# Altium schematic sheet Encoder.SchDoc
size B; DocumentNumber: 5; SheetNumber: 5; SheetTotal: 14; PAGE_TITLE: -
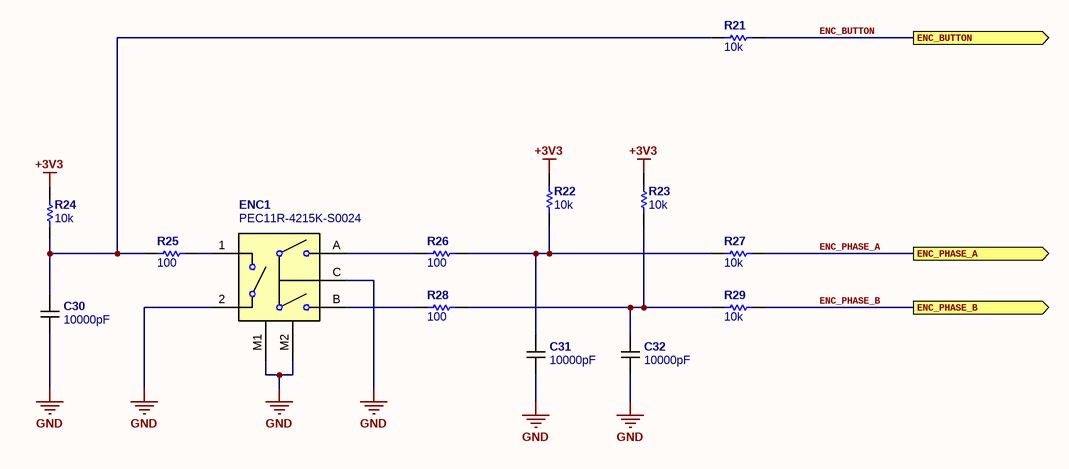
[diagram p0: Encoder.SchDoc]

## Parts
C30  10000pF  [C0603_0.90MM_HD]
C31  10000pF  [C0603_0.90MM_HD]
C32  10000pF  [C0603_0.90MM_HD]
ENC1  PEC11R-4215K-S0024  [PEC11R-4215K-S0024]
R21  10k  [R0603_0.55MM_MD]
R22  10k  [R0603_0.55MM_MD]
R23  10k  [R0603_0.55MM_MD]
R24  10k  [R0603_0.55MM_MD]
R25  100  [R0603_0.55MM_MD]
R26  100  [R0603_0.55MM_MD]
R27  10k  [R0603_0.55MM_MD]
R28  100  [R0603_0.55MM_MD]
R29  10k  [R0603_0.55MM_MD]

## Ports
ENC_BUTTON (out), ENC_PHASE_A (out), ENC_PHASE_B (out)

## Nets
+3V3: R22.2 R23.2 R24.2
GND: C30.1 C31.1 C32.1 ENC1.2 ENC1.C ENC1.M1 ENC1.M2
ENC_BUTTON: R21.1 ; port ENC_BUTTON
ENC_PHASE_A: R27.1 ; port ENC_PHASE_A
ENC_PHASE_B: R29.1 ; port ENC_PHASE_B
NetC30_2: C30.2 R21.2 R24.1 R25.2
NetC31_2: C31.2 R22.1 R26.1 R27.2
NetC32_2: C32.2 R23.1 R28.1 R29.2
NetENC1_1: ENC1.1 R25.1
NetENC1_A: ENC1.A R26.2
NetENC1_B: ENC1.B R28.2

## Notes on the sheet
- PCB REV
- Sheet
- of
- CCA REV

## Library data of the parts
C30-C32 = CGA3E2C0G1H103J080AA: CAP CER 10000PF 50V C0G 0603; Manufacturer: TDK Corporation; Temperature Coefficient: C0G, NP0; Tolerance: ±5%; Substitution Notes: 10000pF , 50V , ±5% , C0G, NP0 , -55°C ~ 125°C , AEC-Q200 , 0603; Value: 10000pF; Manufacturer Part Number: CGA3E2C0G1H103J080AA; ComponentLink1Description: Datasheet (Internal); ComponentLink1URL: datasheets\TDK\mlcc_automotive_general_en.pdf; ComponentLink2Description: Datasheet (External); ComponentLink2URL: https://product.tdk.com/info/en/catalog/datasheets/mlcc_automotive_general_en.pdf; Supplier 1: Digikey; Supplier Part Number 1: 445-6916-1-ND; Category: Capacitors; Voltage - Rated: 50V; Features: -; Operating Temperature: -55°C ~ 125°C; Ratings: AEC-Q200; Package: 0603; Thickness (Max): 0.90MM
ENC1 = PEC11R-4215K-S0024: Encoders 15mm SHAFT w/SWITCH; Manufacturer: Bourns; Number of Channels: 2; Pulses per Revolution: 24; Built in Switch: Yes; Encoder Type: Mechanical; Output Type: Quadrature,Incremental; Max Supply Voltage (DC): 5V; Hole Diameter: 1.8mm; Value: PEC11R-4215K-S0024; Supplier 1: Digi-Key; Supplier Part Number 1: PEC11R-4215K-S0024-ND; Manufacturer Part Number: PEC11R-4215K-S0024; RoHS: Yes; Category: Encoders; Stock: 2990; Pricing: 1=1.68000, 10=1.56600, 25=1.47920, 50=1.30500, 100=1.07300, 250=1.04400, 500=0.98600, 1000=0.92800, 5000=0.81200 (USD); Mount: Through Hole,Panel,PCB; Min Operating Temperature: -30°C; Max Operating Temperature: 70°C; Package Quantity: 150; Packaging: Bulk; Termination: PC Pin; Orientation: Vertical; Detent: Yes; Length: 21.5mm; Height: 13.4mm; Width: 12.5mm; REACH SVHC: No SVHC; ComponentLink1URL: https://datasheet.ciiva.com/29349/pec11r-29349515.pdf?src-supplier=Digi-Key; ComponentLink1Description: https://datasheet.ciiva.com/29349/pec11r-29349515.pdf?src-supplier=Digi-Key; ComponentLink2URL: https://datasheet.ciiva.com/30066/pec11r-221203-30066108.pdf?src-supplier=Onlinecomponents.com; ComponentLink2Description: https://datasheet.ciiva.com/30066/pec11r-221203-30066108.pdf?src-supplier=Onlinecomponents.com; ComponentLink3URL: https://datasheet.ciiva.com/12176/pec11r-221203-12176991.pdf?src-supplier=Mouser; ComponentLink3Description: https://datasheet.ciiva.com/12176/pec11r-221203-12176991.pdf?src-supplier=Mouser
R21-R24 R27 R29 = ERJ-3EKF1002V: RES 10K OHM 1/10W 1% 0603 SMD; Manufacturer: Panasonic Electronic Components; Package Power: 0603  (0.1W); Power (Watts): 0.1W- 1/10W; Temperature Coefficient: ±100ppm/°C; Limiting Element Voltage: 75; Maximum Overload Voltage: 150; Maximum Working Voltage: 31.6V; Substitution Notes: 10k , ±1% , 0603 , AEC-Q200; Value: 10k; Manufacturer Part Number: ERJ-3EKF1002V; ComponentLink1Description: Internal Datasheet; ComponentLink1URL: datasheets\Panasonic Electronic Components\AOA0000CE2.pdf; ComponentLink2Description: External Datasheet; ComponentLink2URL: http://industrial.panasonic.com/www-data/pdf/AOA0000/AOA0000CE2.pdf; Supplier 1: Digi-Key; Supplier Part Number 1: P10.0KHCT-ND; Category: Resistors; Resistance (Ohms): 10k; Composition: Thick Film; Features: -; Tolerance: ±1%; Package: 0603 (1608 Metric); Supplier Package: 0603; Size / Dimension: 0.063" L x 0.031" W (1.60mm x 0.80mm); Height: 0.55MM; Number of Terminations: 2; Packaging: Cut Tape (CT); Sort Value: 10000; Sort Value Package: 603_10000; Ratings: AEC-Q200
R25 R26 R28 = ERJ-3EKF1000V: RES 100 OHM 1/10W 1% 0603 SMD; Manufacturer: Panasonic Electronic Components; Package Power: 0603  (0.1W); Power (Watts): 0.1W- 1/10W; Temperature Coefficient: ±100ppm/°C; Limiting Element Voltage: 75; Maximum Overload Voltage: 150; Maximum Working Voltage: 3.2V; Substitution Notes: 100 , ±1% , 0603 , AEC-Q200; Value: 100; Manufacturer Part Number: ERJ-3EKF1000V; ComponentLink1Description: Internal Datasheet; ComponentLink1URL: datasheets\Panasonic Electronic Components\AOA0000CE2.pdf; ComponentLink2Description: External Datasheet; ComponentLink2URL: http://industrial.panasonic.com/www-data/pdf/AOA0000/AOA0000CE2.pdf; Supplier 1: Digi-Key; Supplier Part Number 1: P100HCT-ND; Category: Resistors; Resistance (Ohms): 100; Composition: Thick Film; Features: -; Tolerance: ±1%; Package: 0603 (1608 Metric); Supplier Package: 0603; Size / Dimension: 0.063" L x 0.031" W (1.60mm x 0.80mm); Height: 0.55MM; Number of Terminations: 2; Packaging: Cut Tape (CT); Sort Value: 100; Sort Value Package: 603_100; Ratings: AEC-Q200